# Altium project EMG_MainBoard_Layout.PrjPcb
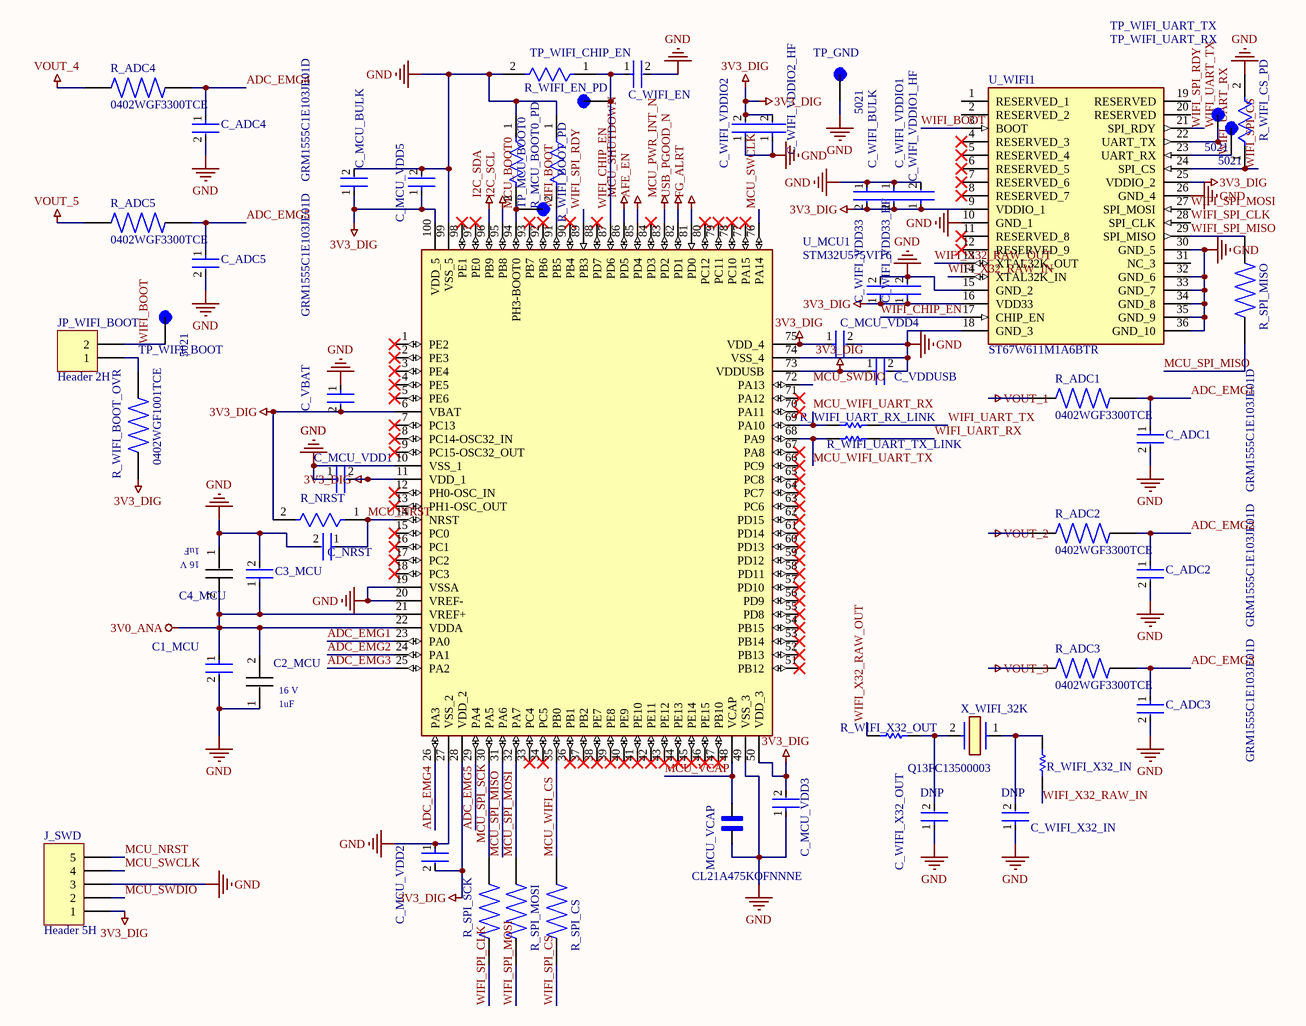
[diagram p0: MCU_sheet.SchDoc]
1 sheet, 59 parts. Net scope: flat (ports and power ports of the same name join across sheets).
Board file: EMG_MainBoard_Layout.PcbDoc

## Sheet MCU_sheet.SchDoc
size 381 x 254 mm; SheetNumber: 8; SheetTotal: 8

### Parts
C1_MCU  GRM155R61C104KA88D  [FP-GRM155-0_05-IPC_C]  (value not drawn)
C2_MCU  MURATA_GRM155C71C105KE11D  [*MURATA_GRM155C71C105KE11D_0]  (value not drawn)
C3_MCU  GRM155R61C104KA88D  [FP-GRM155-0_05-IPC_C]  (value not drawn)
C4_MCU  MURATA_GRM155C71C105KE11D  [*MURATA_GRM155C71C105KE11D_0]  (value not drawn)
C_ADC1  GRM1555C1E103JE01D  [FP-GRM155-0_15-IPC_A]
C_ADC2  GRM1555C1E103JE01D  [FP-GRM155-0_15-IPC_A]
C_ADC3  GRM1555C1E103JE01D  [FP-GRM155-0_15-IPC_A]
C_ADC4  GRM1555C1E103JE01D  [FP-GRM155-0_15-IPC_A]
C_ADC5  GRM1555C1E103JE01D  [FP-GRM155-0_15-IPC_A]
C_MCU_BULK  GCM21BC71E106KE36L  [FP-GCM21B-0_2-e0_2_0_7-MFG]  (value not drawn)
C_MCU_VDD1  GRM155R61C104KA88D  [FP-GRM155-0_05-IPC_C]  (value not drawn)
C_MCU_VDD2  GRM155R61C104KA88D  [FP-GRM155-0_05-IPC_C]  (value not drawn)
C_MCU_VDD3  GRM155R61C104KA88D  [FP-GRM155-0_05-IPC_C]  (value not drawn)
C_MCU_VDD4  GRM155R61C104KA88D  [FP-GRM155-0_05-IPC_C]  (value not drawn)
C_MCU_VDD5  GRM155R61C104KA88D  [FP-GRM155-0_05-IPC_C]  (value not drawn)
C_NRST  GRM155R61C104KA88D  [FP-GRM155-0_05-IPC_C]  (value not drawn)
C_VBAT  GRM155R61C104KA88D  [FP-GRM155-0_05-IPC_C]  (value not drawn)
C_VDDUSB  GRM155R61C104KA88D  [FP-GRM155-0_05-IPC_C]  (value not drawn)
C_WIFI_BULK  GRM219R60J476ME44D  [FP-GRM219-0_2-0_1-IPC_A]  (value not drawn)
C_WIFI_EN  GRM155R61C104KA88D  [FP-GRM155-0_05-IPC_C]  (value not drawn)
C_WIFI_VDD33  GCM21BC71E106KE36L  [FP-GCM21B-0_2-e0_2_0_7-MFG]  (value not drawn)
C_WIFI_VDD33_HF  GRM155R61C104KA88D  [FP-GRM155-0_05-MFG]  (value not drawn)
C_WIFI_VDDIO1  GCM21BC71E106KE36L  [FP-GCM21B-0_2-e0_2_0_7-MFG]  (value not drawn)
C_WIFI_VDDIO1_HF  GRM155R61C104KA88D  [FP-GRM155-0_05-MFG]  (value not drawn)
C_WIFI_VDDIO2  GCM21BC71E106KE36L  [FP-GCM21B-0_2-e0_2_0_7-MFG]  (value not drawn)
C_WIFI_VDDIO2_HF  GRM155R61C104KA88D  [FP-GRM155-0_05-MFG]  (value not drawn)
C_WIFI_X32_IN  DNP  [FP-GRM155-0_05-IPC_C]
C_WIFI_X32_OUT  DNP  [FP-GRM155-0_05-IPC_C]
J_SWD  Header 5H  [HDR1X5H]
JP_WIFI_BOOT  Header 2H  [HDR1X2H]
MCU_VCAP  CL21A475KOFNNNE  [CAPC2012X135N]
R_ADC1  0402WGF3300TCE  [RESC1005X40N]
R_ADC2  0402WGF3300TCE  [RESC1005X40N]
R_ADC3  0402WGF3300TCE  [RESC1005X40N]
R_ADC4  0402WGF3300TCE  [RESC1005X40N]
R_ADC5  0402WGF3300TCE  [RESC1005X40N]
R_MCU_BOOT0_PD  RT0402BRD0710KL  [FP-RT0402-MFG]  (value not drawn)
R_NRST  RT0402BRD0710KL  [FP-RT0402-MFG]  (value not drawn)
R_SPI_CS  ERJ2RKF22R0X  [RES_ERJ2RKF22R0X]  (value not drawn)
R_SPI_MISO  ERJ2RKF22R0X  [RES_ERJ2RKF22R0X]  (value not drawn)
R_SPI_MOSI  ERJ2RKF22R0X  [RES_ERJ2RKF22R0X]  (value not drawn)
R_SPI_SCK  ERJ2RKF22R0X  [RES_ERJ2RKF22R0X]  (value not drawn)
R_WIFI_BOOT_OVR  0402WGF1001TCE  [RESC1005X40N]
R_WIFI_BOOT_PD  RT0402BRD0710KL  [FP-RT0402-MFG]  (value not drawn)
R_WIFI_CS_PD  RT0402BRD0710KL  [FP-RT0402-MFG]  (value not drawn)
R_WIFI_EN_PD  RT0402BRD0710KL  [FP-RT0402-MFG]  (value not drawn)
R_WIFI_UART_RX_LINK  ERJ2GE0R00X  [RESC1005X40X25LL05T05]  (value not drawn)
R_WIFI_UART_TX_LINK  ERJ2GE0R00X  [RESC1005X40X25LL05T05]  (value not drawn)
R_WIFI_X32_IN  ERJ2GE0R00X  [RESC1005X40X25LL05T05]  (value not drawn)
R_WIFI_X32_OUT  ERJ2GE0R00X  [RESC1005X40X25LL05T05]  (value not drawn)
TP_GND  5021  [TP_5021]
TP_MCU_BOOT0  5021  [TP_5021]  (value not drawn)
TP_WIFI_BOOT  5021  [TP_5021]
TP_WIFI_CHIP_EN  5021  [TP_5021]  (value not drawn)
TP_WIFI_UART_RX  5021  [TP_5021]
TP_WIFI_UART_TX  5021  [TP_5021]
U_MCU1  STM32U575VIT6  [QFP50P1600X1600X160-100N]
U_WIFI1  ST67W611M1A6BTR  [ST67W611M1A6BTR]
X_WIFI_32K  Q13FC13500003  [EMG_FC135_3215_2P]

### Nets
3V0_ANA: C1_MCU.1 C2_MCU.2 C3_MCU.1 C4_MCU.2 U_MCU1.21(VREF+) U_MCU1.22(VDDA)
3V3_DIG: C_MCU_BULK.1 C_MCU_VDD1.2 C_MCU_VDD2.2 C_MCU_VDD3.2 C_MCU_VDD4.1 C_MCU_VDD5.1 C_VBAT.2 C_VDDUSB.1 C_WIFI_BULK.2 C_WIFI_VDD33.1 C_WIFI_VDD33_HF.1 C_WIFI_VDDIO1.2 C_WIFI_VDDIO1_HF.1 C_WIFI_VDDIO2.2 C_WIFI_VDDIO2_HF.2 J_SWD.1 R_NRST.2 R_WIFI_BOOT_OVR.1 U_MCU1.6(VBAT) U_MCU1.11(VDD_1) U_MCU1.28(VDD_2) U_MCU1.50(VDD_3) U_MCU1.73(VDDUSB) U_MCU1.75(VDD_4) U_MCU1.100(VDD_5) U_WIFI1.9(VDDIO_1) U_WIFI1.16(VDD33) U_WIFI1.25(VDDIO_2)
AFE_EN: U_MCU1.85(PD4)
FG_ALRT: U_MCU1.81(PD0)
GND: C1_MCU.2 C2_MCU.1 C3_MCU.2 C4_MCU.1 C_ADC1.2 C_ADC2.2 C_ADC3.2 C_ADC4.2 C_ADC5.2 C_MCU_BULK.2 C_MCU_VDD1.1 C_MCU_VDD2.1 C_MCU_VDD3.1 C_MCU_VDD4.2 C_MCU_VDD5.2 C_NRST.2 C_VBAT.1 C_VDDUSB.2 C_WIFI_BULK.1 C_WIFI_EN.2 C_WIFI_VDD33.2 C_WIFI_VDD33_HF.2 C_WIFI_VDDIO1.1 C_WIFI_VDDIO1_HF.2 C_WIFI_VDDIO2.1 C_WIFI_VDDIO2_HF.1 C_WIFI_X32_IN.1 C_WIFI_X32_OUT.1 J_SWD.3 MCU_VCAP.1 R_MCU_BOOT0_PD.1 R_WIFI_BOOT_PD.1 R_WIFI_CS_PD.2 R_WIFI_EN_PD.2 TP_GND.TP U_MCU1.10(VSS_1) U_MCU1.19(VSSA) U_MCU1.20(VREF-) U_MCU1.27(VSS_2) U_MCU1.49(VSS_3) U_MCU1.74(VSS_4) U_MCU1.99(VSS_5) U_WIFI1.10(GND_1) U_WIFI1.15(GND_2) U_WIFI1.18(GND_3) U_WIFI1.26(GND_4) U_WIFI1.30(GND_5) U_WIFI1.32(GND_6) U_WIFI1.33(GND_7) U_WIFI1.34(GND_8) U_WIFI1.35(GND_9) U_WIFI1.36(GND_10)
I2C_SCL: U_MCU1.95(PB8)
I2C_SDA: U_MCU1.96(PB9)
MCU_PWR_INT_N: U_MCU1.83(PD2)
MCU_SHUTDOWN: U_MCU1.86(PD5)
USB_PGOOD_N: U_MCU1.82(PD1)
VOUT_1: R_ADC1.1
VOUT_2: R_ADC2.1
VOUT_3: R_ADC3.1
VOUT_4: R_ADC4.1
VOUT_5: R_ADC5.1
ADC_EMG1: C_ADC1.1 R_ADC1.2 U_MCU1.23(PA0)
ADC_EMG2: C_ADC2.1 R_ADC2.2 U_MCU1.24(PA1)
ADC_EMG3: C_ADC3.1 R_ADC3.2 U_MCU1.25(PA2)
ADC_EMG4: C_ADC4.1 R_ADC4.2 U_MCU1.26(PA3)
ADC_EMG5: C_ADC5.1 R_ADC5.2 U_MCU1.29(PA4)
MCU_BOOT0: R_MCU_BOOT0_PD.2 TP_MCU_BOOT0.TP U_MCU1.94(PH3-BOOT0)
MCU_NRST: C_NRST.1 J_SWD.5 R_NRST.1 U_MCU1.14(NRST)
MCU_SPI_MISO: R_SPI_MISO.2 U_MCU1.31(PA6)
MCU_SPI_MOSI: R_SPI_MOSI.2 U_MCU1.32(PA7)
MCU_SPI_SCK: R_SPI_SCK.2 U_MCU1.30(PA5)
MCU_SWCLK: J_SWD.4 U_MCU1.76(PA14)
MCU_SWDIO: J_SWD.2 U_MCU1.72(PA13)
MCU_VCAP: MCU_VCAP.2 U_MCU1.48(VCAP)
MCU_WIFI_CS: R_SPI_CS.2 U_MCU1.35(PB0)
MCU_WIFI_UART_RX: R_WIFI_UART_RX_LINK.2 U_MCU1.69(PA10)
MCU_WIFI_UART_TX: R_WIFI_UART_TX_LINK.2 U_MCU1.68(PA9)
WIFI_BOOT: JP_WIFI_BOOT.2 R_WIFI_BOOT_PD.2 TP_WIFI_BOOT.TP U_MCU1.91(PB5) U_WIFI1.3(BOOT)
WIFI_CHIP_EN: C_WIFI_EN.1 R_WIFI_EN_PD.1 TP_WIFI_CHIP_EN.TP U_MCU1.87(PD6) U_WIFI1.17(CHIP_EN)
WIFI_SPI_CLK: R_SPI_SCK.1 U_WIFI1.28(SPI_CLK)
WIFI_SPI_CS: R_SPI_CS.1 R_WIFI_CS_PD.1 U_WIFI1.24(SPI_CS)
WIFI_SPI_MISO: R_SPI_MISO.1 U_WIFI1.29(SPI_MISO)
WIFI_SPI_MOSI: R_SPI_MOSI.1 U_WIFI1.27(SPI_MOSI)
WIFI_SPI_RDY: U_MCU1.89(PB3) U_WIFI1.21(SPI_RDY)
WIFI_UART_RX: R_WIFI_UART_TX_LINK.1 TP_WIFI_UART_RX.TP U_WIFI1.23(UART_RX)
WIFI_UART_TX: R_WIFI_UART_RX_LINK.1 TP_WIFI_UART_TX.TP U_WIFI1.22(UART_TX)
WIFI_X32_RAW_IN: R_WIFI_X32_IN.2 U_WIFI1.14(XTAL32K_IN)
WIFI_X32_RAW_OUT: R_WIFI_X32_OUT.2 U_WIFI1.13(XTAL32K_OUT)
NetC_WIFI_X32_IN_2: C_WIFI_X32_IN.2 R_WIFI_X32_IN.1 X_WIFI_32K.1(CRYSTAL_1)
NetC_WIFI_X32_OUT_2: C_WIFI_X32_OUT.2 R_WIFI_X32_OUT.1 X_WIFI_32K.2(CRYSTAL_2)
NetJP_WIFI_BOOT_1: JP_WIFI_BOOT.1 R_WIFI_BOOT_OVR.2

Not connected (* = marked no-connect by the designer): U_MCU1 1(PE2)* 2(PE3)* 3(PE4)* 4(PE5)* 5(PE6)* 7(PC13)* 8(PC14-OSC32_IN)* 9(PC15-OSC32_OUT)* 12(PH0-OSC_IN)* 13(PH1-OSC_OUT)* 15(PC0)* 16(PC1)* 17(PC2)* 18(PC3)* 33(PC4)* 34(PC5)* 36(PB1)* 37(PB2)* 38(PE7)* 39(PE8)* 40(PE9)* 41(PE10)* 42(PE11)* 43(PE12)* 44(PE13)* 45(PE14)* 46(PE15)* 47(PB10)* 51(PB12)* 52(PB13)* 53(PB14)* 54(PB15)* 55(PD8)* 56(PD9)* 57(PD10)* 58(PD11)* 59(PD12)* 60(PD13)* 61(PD14)* 62(PD15)* 63(PC6)* 64(PC7)* 65(PC8)* 66(PC9)* 67(PA8)* 70(PA11)* 71(PA12)* 77(PA15)* 78(PC10)* 79(PC11)* 80(PC12)* 84(PD3)* 88(PD7)* 90(PB4)* 92(PB6)* 93(PB7)* 97(PE0)* 98(PE1)*; U_WIFI1 1(RESERVED_1) 2(RESERVED_2) 4(RESERVED_3)* 5(RESERVED_4)* 6(RESERVED_5)* 7(RESERVED_6)* 8(RESERVED_7)* 11(RESERVED_8)* 12(RESERVED_9)* 19(RESERVED) 20(RESERVED) 31(NC_3)

### Notes on the sheet
- I2C_SDA
- (near R_MCU_BOOT0_PD) I2C_SCL
- MCU_SHUTDOWN
- AFE_EN
- MCU_PWR_INT_N
- USB_PGOOD_N
- FG_ALRT
- (in symbol EMG_R5_C2_MCU) 1uF
- (in symbol EMG_R5_C4_MCU) 1uF

### Library data of the parts
C1_MCU = EMG_R5_C1_MCU: CAP CER 0.1UF 16V X5R 0402; Tolerance: 10%; Capacitance: 100nF; Controlled Revision: R5 2026-09-16; project-local frozen symbol/footprint; Size: 0.5mm; Case Code (Imperial): 0402; Voltage: 16V; REACH SVHC: No SVHC; Packaging: Tape and Reel; Case/Package: 0402; Package Quantity: 1; Max Operating Temperature: 85°C; Voltage Rating (DC): 16V; Min Operating Temperature: -55°C; Construction: Flat; Mount: Surface Mount; Voltage Rating: 16V; Thickness: 0.022inch; Depth: 0.5mm; Termination: SMD/SMT; Length: 1mm; Height: 0.5mm; Series: GRM; Radiation Hardening: No; Width: 0.02inch; RoHS Compliant: Yes; Lead Free: Lead Free; Case Code (Metric): 1005; Dielectric: X5R
C2_MCU = EMG_R5_C2_MCU: Murata GRM155C71C105KE11D: 1 uF 16 V X7S +/-10%, 0402/1005 metric; Value: 1 uF; Controlled Revision: R5 2026-09-16; project-local frozen symbol/footprint; Voltage Rating: 16 V; SnapEDA_Link: https://www.snapeda.com/parts/GRM155C71C105KE11D/Murata/view-part/?ref=snap; Package: 0402 / 1005 metric; MF: Murata; MP: GRM155C71C105KE11D; Check_prices: https://www.snapeda.com/parts/GRM155C71C105KE11D/Murata/view-part/?ref=eda; Manufacturer: Murata; Manufacturer Part Number: GRM155C71C105KE11D; Capacitance: 1 uF; Dielectric: X7S; Tolerance: +/-10%
C3_MCU = EMG_R5_C3_MCU: CAP CER 0.1UF 16V X5R 0402; Tolerance: 10%; Capacitance: 100nF; Controlled Revision: R5 2026-09-16; project-local frozen symbol/footprint; Size: 0.5mm; Case Code (Imperial): 0402; Voltage: 16V; REACH SVHC: No SVHC; Packaging: Tape and Reel; Case/Package: 0402; Package Quantity: 1; Max Operating Temperature: 85°C; Voltage Rating (DC): 16V; Min Operating Temperature: -55°C; Construction: Flat; Mount: Surface Mount; Voltage Rating: 16V; Thickness: 0.022inch; Depth: 0.5mm; Termination: SMD/SMT; Length: 1mm; Height: 0.5mm; Series: GRM; Radiation Hardening: No; Width: 0.02inch; RoHS Compliant: Yes; Lead Free: Lead Free; Case Code (Metric): 1005; Dielectric: X5R
C4_MCU = EMG_R5_C4_MCU: Murata GRM155C71C105KE11D: 1 uF 16 V X7S +/-10%, 0402/1005 metric; Value: 1 uF; Controlled Revision: R5 2026-09-16; project-local frozen symbol/footprint; Voltage Rating: 16 V; SnapEDA_Link: https://www.snapeda.com/parts/GRM155C71C105KE11D/Murata/view-part/?ref=snap; Package: 0402 / 1005 metric; MF: Murata; MP: GRM155C71C105KE11D; Check_prices: https://www.snapeda.com/parts/GRM155C71C105KE11D/Murata/view-part/?ref=eda; Manufacturer: Murata; Manufacturer Part Number: GRM155C71C105KE11D; Capacitance: 1 uF; Dielectric: X7S; Tolerance: +/-10%
C_ADC1 = EMG_R5_C_ADC1: Chip Multilayer Ceramic Capacitors for General Purpose, 0402, 10000pF, C0G, 30ppm/°C, 5%, 25V; Controlled Revision: R5 2026-09-16; project-local frozen symbol/footprint
C_ADC2 = EMG_R5_C_ADC2: Chip Multilayer Ceramic Capacitors for General Purpose, 0402, 10000pF, C0G, 30ppm/°C, 5%, 25V; Controlled Revision: R5 2026-09-16; project-local frozen symbol/footprint
C_ADC3 = EMG_R5_C_ADC3: Chip Multilayer Ceramic Capacitors for General Purpose, 0402, 10000pF, C0G, 30ppm/°C, 5%, 25V; Controlled Revision: R5 2026-09-16; project-local frozen symbol/footprint
C_ADC4 = EMG_R5_C_ADC4: Chip Multilayer Ceramic Capacitors for General Purpose, 0402, 10000pF, C0G, 30ppm/°C, 5%, 25V; Controlled Revision: R5 2026-09-16; project-local frozen symbol/footprint
C_ADC5 = EMG_R5_C_ADC5: Chip Multilayer Ceramic Capacitors for General Purpose, 0402, 10000pF, C0G, 30ppm/°C, 5%, 25V; Controlled Revision: R5 2026-09-16; project-local frozen symbol/footprint
C_MCU_BULK = EMG_R5_C_MCU_BULK: 10 µF ±10% 25V Ceramic Capacitor X7S 0805 (2012 Metric); Controlled Revision: R5 2026-09-16; project-local frozen symbol/footprint
C_MCU_VDD1 = EMG_R5_C_MCU_VDD1: CAP CER 0.1UF 16V X5R 0402; Tolerance: 10%; Capacitance: 100nF; Controlled Revision: R5 2026-09-16; project-local frozen symbol/footprint; Size: 0.5mm; Case Code (Imperial): 0402; Voltage: 16V; REACH SVHC: No SVHC; Packaging: Tape and Reel; Case/Package: 0402; Package Quantity: 1; Max Operating Temperature: 85°C; Voltage Rating (DC): 16V; Min Operating Temperature: -55°C; Construction: Flat; Mount: Surface Mount; Voltage Rating: 16V; Thickness: 0.022inch; Depth: 0.5mm; Termination: SMD/SMT; Length: 1mm; Height: 0.5mm; Series: GRM; Radiation Hardening: No; Width: 0.02inch; RoHS Compliant: Yes; Lead Free: Lead Free; Case Code (Metric): 1005; Dielectric: X5R
C_MCU_VDD2 = EMG_R5_C_MCU_VDD2: CAP CER 0.1UF 16V X5R 0402; Tolerance: 10%; Capacitance: 100nF; Controlled Revision: R5 2026-09-16; project-local frozen symbol/footprint; Size: 0.5mm; Case Code (Imperial): 0402; Voltage: 16V; REACH SVHC: No SVHC; Packaging: Tape and Reel; Case/Package: 0402; Package Quantity: 1; Max Operating Temperature: 85°C; Voltage Rating (DC): 16V; Min Operating Temperature: -55°C; Construction: Flat; Mount: Surface Mount; Voltage Rating: 16V; Thickness: 0.022inch; Depth: 0.5mm; Termination: SMD/SMT; Length: 1mm; Height: 0.5mm; Series: GRM; Radiation Hardening: No; Width: 0.02inch; RoHS Compliant: Yes; Lead Free: Lead Free; Case Code (Metric): 1005; Dielectric: X5R
C_MCU_VDD3 = EMG_R5_C_MCU_VDD3: CAP CER 0.1UF 16V X5R 0402; Tolerance: 10%; Capacitance: 100nF; Controlled Revision: R5 2026-09-16; project-local frozen symbol/footprint; Size: 0.5mm; Case Code (Imperial): 0402; Voltage: 16V; REACH SVHC: No SVHC; Packaging: Tape and Reel; Case/Package: 0402; Package Quantity: 1; Max Operating Temperature: 85°C; Voltage Rating (DC): 16V; Min Operating Temperature: -55°C; Construction: Flat; Mount: Surface Mount; Voltage Rating: 16V; Thickness: 0.022inch; Depth: 0.5mm; Termination: SMD/SMT; Length: 1mm; Height: 0.5mm; Series: GRM; Radiation Hardening: No; Width: 0.02inch; RoHS Compliant: Yes; Lead Free: Lead Free; Case Code (Metric): 1005; Dielectric: X5R
C_MCU_VDD4 = EMG_R5_C_MCU_VDD4: CAP CER 0.1UF 16V X5R 0402; Tolerance: 10%; Capacitance: 100nF; Controlled Revision: R5 2026-09-16; project-local frozen symbol/footprint; Size: 0.5mm; Case Code (Imperial): 0402; Voltage: 16V; REACH SVHC: No SVHC; Packaging: Tape and Reel; Case/Package: 0402; Package Quantity: 1; Max Operating Temperature: 85°C; Voltage Rating (DC): 16V; Min Operating Temperature: -55°C; Construction: Flat; Mount: Surface Mount; Voltage Rating: 16V; Thickness: 0.022inch; Depth: 0.5mm; Termination: SMD/SMT; Length: 1mm; Height: 0.5mm; Series: GRM; Radiation Hardening: No; Width: 0.02inch; RoHS Compliant: Yes; Lead Free: Lead Free; Case Code (Metric): 1005; Dielectric: X5R
C_MCU_VDD5 = EMG_R5_C_MCU_VDD5: CAP CER 0.1UF 16V X5R 0402; Tolerance: 10%; Capacitance: 100nF; Controlled Revision: R5 2026-09-16; project-local frozen symbol/footprint; Size: 0.5mm; Case Code (Imperial): 0402; Voltage: 16V; REACH SVHC: No SVHC; Packaging: Tape and Reel; Case/Package: 0402; Package Quantity: 1; Max Operating Temperature: 85°C; Voltage Rating (DC): 16V; Min Operating Temperature: -55°C; Construction: Flat; Mount: Surface Mount; Voltage Rating: 16V; Thickness: 0.022inch; Depth: 0.5mm; Termination: SMD/SMT; Length: 1mm; Height: 0.5mm; Series: GRM; Radiation Hardening: No; Width: 0.02inch; RoHS Compliant: Yes; Lead Free: Lead Free; Case Code (Metric): 1005; Dielectric: X5R
C_NRST = EMG_R5_C_NRST: CAP CER 0.1UF 16V X5R 0402; Tolerance: 10%; Capacitance: 100nF; Controlled Revision: R5 2026-09-16; project-local frozen symbol/footprint; Size: 0.5mm; Case Code (Imperial): 0402; Voltage: 16V; REACH SVHC: No SVHC; Packaging: Tape and Reel; Case/Package: 0402; Package Quantity: 1; Max Operating Temperature: 85°C; Voltage Rating (DC): 16V; Min Operating Temperature: -55°C; Construction: Flat; Mount: Surface Mount; Voltage Rating: 16V; Thickness: 0.022inch; Depth: 0.5mm; Termination: SMD/SMT; Length: 1mm; Height: 0.5mm; Series: GRM; Radiation Hardening: No; Width: 0.02inch; RoHS Compliant: Yes; Lead Free: Lead Free; Case Code (Metric): 1005; Dielectric: X5R
C_VBAT = EMG_R5_C_VBAT: CAP CER 0.1UF 16V X5R 0402; Tolerance: 10%; Capacitance: 100nF; Controlled Revision: R5 2026-09-16; project-local frozen symbol/footprint; Size: 0.5mm; Case Code (Imperial): 0402; Voltage: 16V; REACH SVHC: No SVHC; Packaging: Tape and Reel; Case/Package: 0402; Package Quantity: 1; Max Operating Temperature: 85°C; Voltage Rating (DC): 16V; Min Operating Temperature: -55°C; Construction: Flat; Mount: Surface Mount; Voltage Rating: 16V; Thickness: 0.022inch; Depth: 0.5mm; Termination: SMD/SMT; Length: 1mm; Height: 0.5mm; Series: GRM; Radiation Hardening: No; Width: 0.02inch; RoHS Compliant: Yes; Lead Free: Lead Free; Case Code (Metric): 1005; Dielectric: X5R
C_VDDUSB = EMG_R5_C_VDDUSB: CAP CER 0.1UF 16V X5R 0402; Tolerance: 10%; Capacitance: 100nF; Controlled Revision: R5 2026-09-16; project-local frozen symbol/footprint; Size: 0.5mm; Case Code (Imperial): 0402; Voltage: 16V; REACH SVHC: No SVHC; Packaging: Tape and Reel; Case/Package: 0402; Package Quantity: 1; Max Operating Temperature: 85°C; Voltage Rating (DC): 16V; Min Operating Temperature: -55°C; Construction: Flat; Mount: Surface Mount; Voltage Rating: 16V; Thickness: 0.022inch; Depth: 0.5mm; Termination: SMD/SMT; Length: 1mm; Height: 0.5mm; Series: GRM; Radiation Hardening: No; Width: 0.02inch; RoHS Compliant: Yes; Lead Free: Lead Free; Case Code (Metric): 1005; Dielectric: X5R
C_WIFI_BULK = EMG_R5_C_WIFI_BULK: Chip Multilayer Ceramic Capacitors for General Purpose, 0805, 47uF, X5R, 15%, 20%, 6.3V; Assembly PROTO_1: Not Fitted; Release Note: Optional 47 uF radio bulk; retained footprint, initial prototype DNP; Controlled Revision: R5 2026-09-16; project-local frozen symbol/footprint; Assembly PROTO_1_REMOTE_NTC: Not Fitted; Case Code (Metric): 2012; Voltage Rating: 6.3V; Case Code (Imperial): 0805; Max Operating Temperature: 85°C; Width: 0.049inch; Length: 0.079inch; Min Operating Temperature: -55°C; Mount: Surface Mount; Packaging: Tape and Reel; Case/Package: 0805; Thickness: 0.037inch; Capacitance: 47uF; Tolerance: 20%
C_WIFI_EN = EMG_R5_C_WIFI_EN: CAP CER 0.1UF 16V X5R 0402; Tolerance: 10%; Capacitance: 100nF; Controlled Revision: R5 2026-09-16; project-local frozen symbol/footprint; Size: 0.5mm; Case Code (Imperial): 0402; Voltage: 16V; REACH SVHC: No SVHC; Packaging: Tape and Reel; Case/Package: 0402; Package Quantity: 1; Max Operating Temperature: 85°C; Voltage Rating (DC): 16V; Min Operating Temperature: -55°C; Construction: Flat; Mount: Surface Mount; Voltage Rating: 16V; Thickness: 0.022inch; Depth: 0.5mm; Termination: SMD/SMT; Length: 1mm; Height: 0.5mm; Series: GRM; Radiation Hardening: No; Width: 0.02inch; RoHS Compliant: Yes; Lead Free: Lead Free; Case Code (Metric): 1005; Dielectric: X5R
C_WIFI_VDD33 = EMG_R5_C_WIFI_VDD33: 10 µF ±10% 25V Ceramic Capacitor X7S 0805 (2012 Metric); Controlled Revision: R5 2026-09-16; project-local frozen symbol/footprint
C_WIFI_VDD33_HF = EMG_R5_C_WIFI_VDD33_HF: CAP CER 0.1UF 16V X5R 0402; Tolerance: 10%; Capacitance: 100nF; Controlled Revision: R5 2026-09-16; project-local frozen symbol/footprint; Size: 0.5mm; Case Code (Imperial): 0402; Voltage: 16V; REACH SVHC: No SVHC; Packaging: Tape and Reel; Case/Package: 0402; Package Quantity: 1; Max Operating Temperature: 85°C; Voltage Rating (DC): 16V; Min Operating Temperature: -55°C; Construction: Flat; Mount: Surface Mount; Voltage Rating: 16V; Thickness: 0.022inch; Depth: 0.5mm; Termination: SMD/SMT; Length: 1mm; Height: 0.5mm; Series: GRM; Radiation Hardening: No; Width: 0.02inch; RoHS Compliant: Yes; Lead Free: Lead Free; Case Code (Metric): 1005; Dielectric: X5R
C_WIFI_VDDIO1 = EMG_R5_C_WIFI_VDDIO1: 10 µF ±10% 25V Ceramic Capacitor X7S 0805 (2012 Metric); Controlled Revision: R5 2026-09-16; project-local frozen symbol/footprint
C_WIFI_VDDIO1_HF = EMG_R5_C_WIFI_VDDIO1_HF: CAP CER 0.1UF 16V X5R 0402; Tolerance: 10%; Capacitance: 100nF; Controlled Revision: R5 2026-09-16; project-local frozen symbol/footprint; Size: 0.5mm; Case Code (Imperial): 0402; Voltage: 16V; REACH SVHC: No SVHC; Packaging: Tape and Reel; Case/Package: 0402; Package Quantity: 1; Max Operating Temperature: 85°C; Voltage Rating (DC): 16V; Min Operating Temperature: -55°C; Construction: Flat; Mount: Surface Mount; Voltage Rating: 16V; Thickness: 0.022inch; Depth: 0.5mm; Termination: SMD/SMT; Length: 1mm; Height: 0.5mm; Series: GRM; Radiation Hardening: No; Width: 0.02inch; RoHS Compliant: Yes; Lead Free: Lead Free; Case Code (Metric): 1005; Dielectric: X5R
C_WIFI_VDDIO2 = EMG_R5_C_WIFI_VDDIO2: 10 µF ±10% 25V Ceramic Capacitor X7S 0805 (2012 Metric); Controlled Revision: R5 2026-09-16; project-local frozen symbol/footprint
C_WIFI_VDDIO2_HF = EMG_R5_C_WIFI_VDDIO2_HF: CAP CER 0.1UF 16V X5R 0402; Tolerance: 10%; Capacitance: 100nF; Controlled Revision: R5 2026-09-16; project-local frozen symbol/footprint; Size: 0.5mm; Case Code (Imperial): 0402; Voltage: 16V; REACH SVHC: No SVHC; Packaging: Tape and Reel; Case/Package: 0402; Package Quantity: 1; Max Operating Temperature: 85°C; Voltage Rating (DC): 16V; Min Operating Temperature: -55°C; Construction: Flat; Mount: Surface Mount; Voltage Rating: 16V; Thickness: 0.022inch; Depth: 0.5mm; Termination: SMD/SMT; Length: 1mm; Height: 0.5mm; Series: GRM; Radiation Hardening: No; Width: 0.02inch; RoHS Compliant: Yes; Lead Free: Lead Free; Case Code (Metric): 1005; Dielectric: X5R
C_WIFI_X32_IN = EMG_R5_C_WIFI_X32_IN: DNP - 32 kHz crystal tuning capacitor; no fitted value or MPN; retain 0402 footprint; Value: DNP - tuning; Assembly PROTO_1: Not Fitted; Release Note: No fitted capacitance or MPN. Qualify pF tuning if required; never fit copied 100 nF.; Controlled Revision: R5 2026-09-16; project-local frozen symbol/footprint; Assembly PROTO_1_REMOTE_NTC: Not Fitted; Package: 0402 / 1005 metric
C_WIFI_X32_OUT = EMG_R5_C_WIFI_X32_OUT: DNP - 32 kHz crystal tuning capacitor; no fitted value or MPN; retain 0402 footprint; Value: DNP - tuning; Assembly PROTO_1: Not Fitted; Release Note: No fitted capacitance or MPN. Qualify pF tuning if required; never fit copied 100 nF.; Controlled Revision: R5 2026-09-16; project-local frozen symbol/footprint; Assembly PROTO_1_REMOTE_NTC: Not Fitted; Package: 0402 / 1005 metric
J_SWD = EMG_R5_J_SWD: Header, 5-Pin, Right Angle; Controlled Revision: R5 2026-09-16; project-local frozen symbol/footprint; Production Release Blocker: Freeze exact orderable manufacturer/MPN, package/mating/contact definition before production; do not infer from generic symbol.; LatestRevisionDate: 17-Jul-2002; LatestRevisionNote: Re-released for DXP Platform.; Publisher: Altium Limited
JP_WIFI_BOOT = EMG_R5_JP_WIFI_BOOT: Header, 2-Pin, Right Angle; Controlled Revision: R5 2026-09-16; project-local frozen symbol/footprint; Production Release Blocker: Freeze exact orderable manufacturer/MPN, package/mating/contact definition before production; do not infer from generic symbol.; LatestRevisionDate: 17-Jul-2002; LatestRevisionNote: Re-released for DXP Platform.; Publisher: Altium Limited
MCU_VCAP = EMG_R5_MCU_VCAP: 4.7 ÂµF Â±10% 16V Ceramic Capacitor X5R 0805 (2012 Metric); MF: Samsung; Controlled Revision: R5 2026-09-16; project-local frozen symbol/footprint; SnapEDA_Link: https://www.snapeda.com/parts/CL21A475KOFNNNE/Samsung/view-part/?ref=snap; Package: SMD-2 Samsung; Value: *; MP: CL21A475KOFNNNE; Check_prices: https://www.snapeda.com/parts/CL21A475KOFNNNE/Samsung/view-part/?ref=eda
R_ADC1 = EMG_R5_R_ADC1: 330 Ohm 1/16W Thick Film Resistor 0402 Chip - Surface Mount; MF: Uni-Royal; Controlled Revision: R5 2026-09-16; project-local frozen symbol/footprint; SnapEDA_Link: https://www.snapeda.com/parts/0402WGF3300TCE/Uni-Royal/view-part/?ref=snap; Package: 0402-2 ROYAL; Value: *; MP: 0402WGF3300TCE; Check_prices: https://www.snapeda.com/parts/0402WGF3300TCE/Uni-Royal/view-part/?ref=eda
R_ADC2 = EMG_R5_R_ADC2: 330 Ohm 1/16W Thick Film Resistor 0402 Chip - Surface Mount; MF: Uni-Royal; Controlled Revision: R5 2026-09-16; project-local frozen symbol/footprint; SnapEDA_Link: https://www.snapeda.com/parts/0402WGF3300TCE/Uni-Royal/view-part/?ref=snap; Package: 0402-2 ROYAL; Value: *; MP: 0402WGF3300TCE; Check_prices: https://www.snapeda.com/parts/0402WGF3300TCE/Uni-Royal/view-part/?ref=eda
R_ADC3 = EMG_R5_R_ADC3: 330 Ohm 1/16W Thick Film Resistor 0402 Chip - Surface Mount; MF: Uni-Royal; Controlled Revision: R5 2026-09-16; project-local frozen symbol/footprint; SnapEDA_Link: https://www.snapeda.com/parts/0402WGF3300TCE/Uni-Royal/view-part/?ref=snap; Package: 0402-2 ROYAL; Value: *; MP: 0402WGF3300TCE; Check_prices: https://www.snapeda.com/parts/0402WGF3300TCE/Uni-Royal/view-part/?ref=eda
R_ADC4 = EMG_R5_R_ADC4: 330 Ohm 1/16W Thick Film Resistor 0402 Chip - Surface Mount; MF: Uni-Royal; Controlled Revision: R5 2026-09-16; project-local frozen symbol/footprint; SnapEDA_Link: https://www.snapeda.com/parts/0402WGF3300TCE/Uni-Royal/view-part/?ref=snap; Package: 0402-2 ROYAL; Value: *; MP: 0402WGF3300TCE; Check_prices: https://www.snapeda.com/parts/0402WGF3300TCE/Uni-Royal/view-part/?ref=eda
R_ADC5 = EMG_R5_R_ADC5: 330 Ohm 1/16W Thick Film Resistor 0402 Chip - Surface Mount; MF: Uni-Royal; Controlled Revision: R5 2026-09-16; project-local frozen symbol/footprint; SnapEDA_Link: https://www.snapeda.com/parts/0402WGF3300TCE/Uni-Royal/view-part/?ref=snap; Package: 0402-2 ROYAL; Value: *; MP: 0402WGF3300TCE; Check_prices: https://www.snapeda.com/parts/0402WGF3300TCE/Uni-Royal/view-part/?ref=eda
R_MCU_BOOT0_PD = EMG_R5_R_MCU_BOOT0_PD: RES 10.0K OHM 1/16W .1% SMD 0402; Manufacturer: Yageo; Value: 10KΩ; Voltage Rating: 50V; Power Rating: 0.063W; Temperature Coefficient: 25 ppm/°C; Tolerance: 0.001; Controlled Revision: R5 2026-09-16; project-local frozen symbol/footprint; Height: 0.35mm; Ipc Land Pattern Name: RESC10050X30; Device Class L1: Passive Components; Mouser Description: Thin Film Resistors - SMD 10K ohm 0.1% 1/16W; ComponentLink2URL: http://www.yageo.com/documents/recent/PYu-RT_1-to-0.01_RoHS_L_9.pdf; Automotive: No; Series: RT; Package: RT0402; ComponentLink2Description: Datasheet; Footprint Url: http://www.yageo.com/exep/pages/download/literatures/PYu-R_Mount_10.pdf; Digikey Description: RES 10.0K OHM 1/16W .1% SMD 0402; Resistance: 10KΩ; Temperature Range High: +155°C; Device Class L3: Chip SMD Resistors; Manufacturer Part Number: RT0402BRD0710KL; Lead Free: Yes; Category: Res; Device Class L2: Resistors; RoHS: TRUE; Temperature Range Low: -55°C; Composition: Thin Film; Temperature: -55°C to +155°C; Octopart: https://octopart.com/rt0402brd0710kl-yageo-1181432
R_NRST = EMG_R5_R_NRST: RES 10.0K OHM 1/16W .1% SMD 0402; Manufacturer: Yageo; Value: 10KΩ; Voltage Rating: 50V; Power Rating: 0.063W; Temperature Coefficient: 25 ppm/°C; Tolerance: 0.001; Controlled Revision: R5 2026-09-16; project-local frozen symbol/footprint; Height: 0.35mm; Ipc Land Pattern Name: RESC10050X30; Device Class L1: Passive Components; Mouser Description: Thin Film Resistors - SMD 10K ohm 0.1% 1/16W; ComponentLink2URL: http://www.yageo.com/documents/recent/PYu-RT_1-to-0.01_RoHS_L_9.pdf; Automotive: No; Series: RT; Package: RT0402; ComponentLink2Description: Datasheet; Footprint Url: http://www.yageo.com/exep/pages/download/literatures/PYu-R_Mount_10.pdf; Digikey Description: RES 10.0K OHM 1/16W .1% SMD 0402; Resistance: 10KΩ; Temperature Range High: +155°C; Device Class L3: Chip SMD Resistors; Manufacturer Part Number: RT0402BRD0710KL; Lead Free: Yes; Category: Res; Device Class L2: Resistors; RoHS: TRUE; Temperature Range Low: -55°C; Composition: Thin Film; Temperature: -55°C to +155°C; Octopart: https://octopart.com/rt0402brd0710kl-yageo-1181432
R_SPI_CS = EMG_R5_R_SPI_CS: 22 Ohms Â±1% 0.1W, 1/10W Chip Resistor 0402 (1005 Metric) Automotive AEC-Q200 Thick Film; MF: Panasonic; Controlled Revision: R5 2026-09-16; project-local frozen symbol/footprint; MP: ERJ2RKF22R0X; Package: 1005-2 Panasonic; Value: *; Digi-Key_Part_Number: P22.0LTR-ND; Check_prices: https://www.snapeda.com/parts/ERJ2RKF22R0X/Panasonic/view-part/?ref=eda; SnapEDA_Link: https://www.snapeda.com/parts/ERJ2RKF22R0X/Panasonic/view-part/?ref=snap
R_SPI_MISO = EMG_R5_R_SPI_MISO: 22 Ohms Â±1% 0.1W, 1/10W Chip Resistor 0402 (1005 Metric) Automotive AEC-Q200 Thick Film; MF: Panasonic; Controlled Revision: R5 2026-09-16; project-local frozen symbol/footprint; MP: ERJ2RKF22R0X; Package: 1005-2 Panasonic; Value: *; Digi-Key_Part_Number: P22.0LTR-ND; Check_prices: https://www.snapeda.com/parts/ERJ2RKF22R0X/Panasonic/view-part/?ref=eda; SnapEDA_Link: https://www.snapeda.com/parts/ERJ2RKF22R0X/Panasonic/view-part/?ref=snap
R_SPI_MOSI = EMG_R5_R_SPI_MOSI: 22 Ohms Â±1% 0.1W, 1/10W Chip Resistor 0402 (1005 Metric) Automotive AEC-Q200 Thick Film; MF: Panasonic; Controlled Revision: R5 2026-09-16; project-local frozen symbol/footprint; MP: ERJ2RKF22R0X; Package: 1005-2 Panasonic; Value: *; Digi-Key_Part_Number: P22.0LTR-ND; Check_prices: https://www.snapeda.com/parts/ERJ2RKF22R0X/Panasonic/view-part/?ref=eda; SnapEDA_Link: https://www.snapeda.com/parts/ERJ2RKF22R0X/Panasonic/view-part/?ref=snap
R_SPI_SCK = EMG_R5_R_SPI_SCK: 22 Ohms Â±1% 0.1W, 1/10W Chip Resistor 0402 (1005 Metric) Automotive AEC-Q200 Thick Film; MF: Panasonic; Controlled Revision: R5 2026-09-16; project-local frozen symbol/footprint; MP: ERJ2RKF22R0X; Package: 1005-2 Panasonic; Value: *; Digi-Key_Part_Number: P22.0LTR-ND; Check_prices: https://www.snapeda.com/parts/ERJ2RKF22R0X/Panasonic/view-part/?ref=eda; SnapEDA_Link: https://www.snapeda.com/parts/ERJ2RKF22R0X/Panasonic/view-part/?ref=snap
R_WIFI_BOOT_OVR = EMG_R5_R_WIFI_BOOT_OVR: 1K Ohm 1/16W Thick Film Resistor 0402 Chip - Surface Mount; MF: Uni-Royal; Controlled Revision: R5 2026-09-16; project-local frozen symbol/footprint; SnapEDA_Link: https://www.snapeda.com/parts/0402WGF1001TCE/Uni-Royal/view-part/?ref=snap; Package: 0402-2 ROYAL; Value: *; MP: 0402WGF1001TCE; Check_prices: https://www.snapeda.com/parts/0402WGF1001TCE/Uni-Royal/view-part/?ref=eda
R_WIFI_BOOT_PD = EMG_R5_R_WIFI_BOOT_PD: RES 10.0K OHM 1/16W .1% SMD 0402; Manufacturer: Yageo; Value: 10KΩ; Voltage Rating: 50V; Power Rating: 0.063W; Temperature Coefficient: 25 ppm/°C; Tolerance: 0.001; Controlled Revision: R5 2026-09-16; project-local frozen symbol/footprint; Height: 0.35mm; Ipc Land Pattern Name: RESC10050X30; Device Class L1: Passive Components; Mouser Description: Thin Film Resistors - SMD 10K ohm 0.1% 1/16W; ComponentLink2URL: http://www.yageo.com/documents/recent/PYu-RT_1-to-0.01_RoHS_L_9.pdf; Automotive: No; Series: RT; Package: RT0402; ComponentLink2Description: Datasheet; Footprint Url: http://www.yageo.com/exep/pages/download/literatures/PYu-R_Mount_10.pdf; Digikey Description: RES 10.0K OHM 1/16W .1% SMD 0402; Resistance: 10KΩ; Temperature Range High: +155°C; Device Class L3: Chip SMD Resistors; Manufacturer Part Number: RT0402BRD0710KL; Lead Free: Yes; Category: Res; Device Class L2: Resistors; RoHS: TRUE; Temperature Range Low: -55°C; Composition: Thin Film; Temperature: -55°C to +155°C; Octopart: https://octopart.com/rt0402brd0710kl-yageo-1181432
R_WIFI_CS_PD = EMG_R5_R_WIFI_CS_PD: RES 10.0K OHM 1/16W .1% SMD 0402; Manufacturer: Yageo; Value: 10KΩ; Voltage Rating: 50V; Power Rating: 0.063W; Temperature Coefficient: 25 ppm/°C; Tolerance: 0.001; Controlled Revision: R5 2026-09-16; project-local frozen symbol/footprint; Height: 0.35mm; Ipc Land Pattern Name: RESC10050X30; Device Class L1: Passive Components; Mouser Description: Thin Film Resistors - SMD 10K ohm 0.1% 1/16W; ComponentLink2URL: http://www.yageo.com/documents/recent/PYu-RT_1-to-0.01_RoHS_L_9.pdf; Automotive: No; Series: RT; Package: RT0402; ComponentLink2Description: Datasheet; Footprint Url: http://www.yageo.com/exep/pages/download/literatures/PYu-R_Mount_10.pdf; Digikey Description: RES 10.0K OHM 1/16W .1% SMD 0402; Resistance: 10KΩ; Temperature Range High: +155°C; Device Class L3: Chip SMD Resistors; Manufacturer Part Number: RT0402BRD0710KL; Lead Free: Yes; Category: Res; Device Class L2: Resistors; RoHS: TRUE; Temperature Range Low: -55°C; Composition: Thin Film; Temperature: -55°C to +155°C; Octopart: https://octopart.com/rt0402brd0710kl-yageo-1181432
R_WIFI_EN_PD = EMG_R5_R_WIFI_EN_PD: RES 10.0K OHM 1/16W .1% SMD 0402; Manufacturer: Yageo; Value: 10KΩ; Voltage Rating: 50V; Power Rating: 0.063W; Temperature Coefficient: 25 ppm/°C; Tolerance: 0.001; Controlled Revision: R5 2026-09-16; project-local frozen symbol/footprint; Height: 0.35mm; Ipc Land Pattern Name: RESC10050X30; Device Class L1: Passive Components; Mouser Description: Thin Film Resistors - SMD 10K ohm 0.1% 1/16W; ComponentLink2URL: http://www.yageo.com/documents/recent/PYu-RT_1-to-0.01_RoHS_L_9.pdf; Automotive: No; Series: RT; Package: RT0402; ComponentLink2Description: Datasheet; Footprint Url: http://www.yageo.com/exep/pages/download/literatures/PYu-R_Mount_10.pdf; Digikey Description: RES 10.0K OHM 1/16W .1% SMD 0402; Resistance: 10KΩ; Temperature Range High: +155°C; Device Class L3: Chip SMD Resistors; Manufacturer Part Number: RT0402BRD0710KL; Lead Free: Yes; Category: Res; Device Class L2: Resistors; RoHS: TRUE; Temperature Range Low: -55°C; Composition: Thin Film; Temperature: -55°C to +155°C; Octopart: https://octopart.com/rt0402brd0710kl-yageo-1181432
R_WIFI_UART_RX_LINK = EMG_R5_R_WIFI_UART_RX_LINK: Chip Resistor, 0 Ohm, 0.1 W, -55 to 155 degC, 0402 (1005 Metric), RoHS, Tape and Reel; Manufacturer: Panasonic; Voltage Rating (DC): 50V; Temperature Coefficient: 600ppm/��C; Max Power Dissipation: 100mW; Resistance: 0mOhm; Tolerance: 5%; Controlled Revision: R5 2026-09-16; project-local frozen symbol/footprint; Number of Terminations: 2; Mount: SurfaceMount; Height: 0.35mm; Packaging: TapeandReel; Contact Plating: Tin; Manufacturer URL: http://www.panasonic.com/; Composition: ThickFilm; Max Operating Temperature: 155degC; REACH SVHC: NoSVHC; Case/Package: 0402; Package Reference: 402; Depth: 0.5mm; Package Description: 2-Pin Surface Mount Device, Body 1 x 0.5 mm; Datasheet URL: https://industrial.panasonic.com/cdbs/www-data/pdf/RDA0000/AOA0000C301.pdf; RoHSCompliant: True; Case Code (Imperial): 0402; Military Standard: Not; Min Operating Temperature: -55degC; Power Rating: 100mW; Datasheet Version: 03/2015; Length: 1mm; Case Code (Metric): 1005; Termination: SMD/SMT; Mounting Technology: SurfaceMount; Voltage Rating: 50V; Width: 0.02inch; Package Quantity: 1; Lead Free: LeadFree; Radiation Hardening: No
R_WIFI_UART_TX_LINK = EMG_R5_R_WIFI_UART_TX_LINK: Chip Resistor, 0 Ohm, 0.1 W, -55 to 155 degC, 0402 (1005 Metric), RoHS, Tape and Reel; Manufacturer: Panasonic; Voltage Rating (DC): 50V; Temperature Coefficient: 600ppm/��C; Max Power Dissipation: 100mW; Resistance: 0mOhm; Tolerance: 5%; Controlled Revision: R5 2026-09-16; project-local frozen symbol/footprint; Number of Terminations: 2; Mount: SurfaceMount; Height: 0.35mm; Packaging: TapeandReel; Contact Plating: Tin; Manufacturer URL: http://www.panasonic.com/; Composition: ThickFilm; Max Operating Temperature: 155degC; REACH SVHC: NoSVHC; Case/Package: 0402; Package Reference: 402; Depth: 0.5mm; Package Description: 2-Pin Surface Mount Device, Body 1 x 0.5 mm; Datasheet URL: https://industrial.panasonic.com/cdbs/www-data/pdf/RDA0000/AOA0000C301.pdf; RoHSCompliant: True; Case Code (Imperial): 0402; Military Standard: Not; Min Operating Temperature: -55degC; Power Rating: 100mW; Datasheet Version: 03/2015; Length: 1mm; Case Code (Metric): 1005; Termination: SMD/SMT; Mounting Technology: SurfaceMount; Voltage Rating: 50V; Width: 0.02inch; Package Quantity: 1; Lead Free: LeadFree; Radiation Hardening: No
R_WIFI_X32_IN = EMG_R5_R_WIFI_X32_IN: Chip Resistor, 0 Ohm, 0.1 W, -55 to 155 degC, 0402 (1005 Metric), RoHS, Tape and Reel; Manufacturer: Panasonic; Voltage Rating (DC): 50V; Temperature Coefficient: 600ppm/��C; Max Power Dissipation: 100mW; Resistance: 0mOhm; Tolerance: 5%; Controlled Revision: R5 2026-09-16; project-local frozen symbol/footprint; Number of Terminations: 2; Mount: SurfaceMount; Height: 0.35mm; Packaging: TapeandReel; Contact Plating: Tin; Manufacturer URL: http://www.panasonic.com/; Composition: ThickFilm; Max Operating Temperature: 155degC; REACH SVHC: NoSVHC; Case/Package: 0402; Package Reference: 402; Depth: 0.5mm; Package Description: 2-Pin Surface Mount Device, Body 1 x 0.5 mm; Datasheet URL: https://industrial.panasonic.com/cdbs/www-data/pdf/RDA0000/AOA0000C301.pdf; RoHSCompliant: True; Case Code (Imperial): 0402; Military Standard: Not; Min Operating Temperature: -55degC; Power Rating: 100mW; Datasheet Version: 03/2015; Length: 1mm; Case Code (Metric): 1005; Termination: SMD/SMT; Mounting Technology: SurfaceMount; Voltage Rating: 50V; Width: 0.02inch; Package Quantity: 1; Lead Free: LeadFree; Radiation Hardening: No
R_WIFI_X32_OUT = EMG_R5_R_WIFI_X32_OUT: Chip Resistor, 0 Ohm, 0.1 W, -55 to 155 degC, 0402 (1005 Metric), RoHS, Tape and Reel; Manufacturer: Panasonic; Voltage Rating (DC): 50V; Temperature Coefficient: 600ppm/��C; Max Power Dissipation: 100mW; Resistance: 0mOhm; Tolerance: 5%; Controlled Revision: R5 2026-09-16; project-local frozen symbol/footprint; Number of Terminations: 2; Mount: SurfaceMount; Height: 0.35mm; Packaging: TapeandReel; Contact Plating: Tin; Manufacturer URL: http://www.panasonic.com/; Composition: ThickFilm; Max Operating Temperature: 155degC; REACH SVHC: NoSVHC; Case/Package: 0402; Package Reference: 402; Depth: 0.5mm; Package Description: 2-Pin Surface Mount Device, Body 1 x 0.5 mm; Datasheet URL: https://industrial.panasonic.com/cdbs/www-data/pdf/RDA0000/AOA0000C301.pdf; RoHSCompliant: True; Case Code (Imperial): 0402; Military Standard: Not; Min Operating Temperature: -55degC; Power Rating: 100mW; Datasheet Version: 03/2015; Length: 1mm; Case Code (Metric): 1005; Termination: SMD/SMT; Mounting Technology: SurfaceMount; Voltage Rating: 50V; Width: 0.02inch; Package Quantity: 1; Lead Free: LeadFree; Radiation Hardening: No
TP_GND = EMG_R5_TP_GND: UltraLow Profile THM Test Point-No Base; MF: Keystone Electronics; Controlled Revision: R5 2026-09-16; project-local frozen symbol/footprint; SnapEDA_Link: https://www.snapeda.com/parts/5021/Keystone/view-part/?ref=snap; Package: None; Value: *; MP: 5021; Check_prices: https://www.snapeda.com/parts/5021/Keystone/view-part/?ref=eda
TP_MCU_BOOT0 = EMG_R5_TP_MCU_BOOT0: UltraLow Profile THM Test Point-No Base; MF: Keystone Electronics; Controlled Revision: R5 2026-09-16; project-local frozen symbol/footprint; SnapEDA_Link: https://www.snapeda.com/parts/5021/Keystone/view-part/?ref=snap; Package: None; Value: *; MP: 5021; Check_prices: https://www.snapeda.com/parts/5021/Keystone/view-part/?ref=eda
TP_WIFI_BOOT = EMG_R5_TP_WIFI_BOOT: UltraLow Profile THM Test Point-No Base; MF: Keystone Electronics; Controlled Revision: R5 2026-09-16; project-local frozen symbol/footprint; SnapEDA_Link: https://www.snapeda.com/parts/5021/Keystone/view-part/?ref=snap; Package: None; Value: *; MP: 5021; Check_prices: https://www.snapeda.com/parts/5021/Keystone/view-part/?ref=eda
TP_WIFI_CHIP_EN = EMG_R5_TP_WIFI_CHIP_EN: UltraLow Profile THM Test Point-No Base; MF: Keystone Electronics; Controlled Revision: R5 2026-09-16; project-local frozen symbol/footprint; SnapEDA_Link: https://www.snapeda.com/parts/5021/Keystone/view-part/?ref=snap; Package: None; Value: *; MP: 5021; Check_prices: https://www.snapeda.com/parts/5021/Keystone/view-part/?ref=eda
TP_WIFI_UART_RX = EMG_R5_TP_WIFI_UART_RX: UltraLow Profile THM Test Point-No Base; MF: Keystone Electronics; Controlled Revision: R5 2026-09-16; project-local frozen symbol/footprint; SnapEDA_Link: https://www.snapeda.com/parts/5021/Keystone/view-part/?ref=snap; Package: None; Value: *; MP: 5021; Check_prices: https://www.snapeda.com/parts/5021/Keystone/view-part/?ref=eda
TP_WIFI_UART_TX = EMG_R5_TP_WIFI_UART_TX: UltraLow Profile THM Test Point-No Base; MF: Keystone Electronics; Controlled Revision: R5 2026-09-16; project-local frozen symbol/footprint; SnapEDA_Link: https://www.snapeda.com/parts/5021/Keystone/view-part/?ref=snap; Package: None; Value: *; MP: 5021; Check_prices: https://www.snapeda.com/parts/5021/Keystone/view-part/?ref=eda
U_MCU1 = EMG_R5_U_MCU1: Integrated Circuit; Manufacturer_Name: STMicroelectronics; Controlled Revision: R5 2026-09-16; project-local frozen symbol/footprint; Datasheet Link: https://www.st.com/resource/en/datasheet/stm32u575ag.pdf; Height: 1.6mm; Manufacturer_Part_Number: STM32U575VIT6; Mouser Part Number: 511-STM32U575VIT6; Mouser Price/Stock: https://www.mouser.co.uk/ProductDetail/STMicroelectronics/STM32U575VIT6?qs=DRkmTr78QAR9I8TWG1L7Og%3D%3D; Arrow Part Number: STM32U575VIT6; Arrow Price/Stock: https://www.arrow.com/en/products/stm32u575vit6/stmicroelectronics.html?utm_currency=USD&region=nac
U_WIFI1 = EMG_R5_U_WIFI1: Integrated Circuit; Manufacturer_Name: STMicroelectronics; Controlled Revision: R5 2026-09-16; project-local frozen symbol/footprint; Datasheet Link: https://www.st.com/resource/en/datasheet/st67w611m1.pdf; Height: 2.37mm; Manufacturer_Part_Number: ST67W611M1A6BTR; Arrow Part Number: ST67W611M1A6BTR; Arrow Price/Stock: https://www.arrow.com/en/products/st67w611m1a6btr/stmicroelectronics.html?utm_currency=USD&region=nac
X_WIFI_32K = EMG_R5_X_WIFI_32K: Epson FC-135 32.768 kHz 9 pF +/-20 ppm, ESR 70 kohm max, 3.2x1.5 mm, 2 terminals; Manufacturer: Seiko Epson Corporation; Load Capacitance: 9 pF; Tolerance: +/-20 ppm at 25 degC, 0.1 uW; ESR: 70 kohm maximum; Drive Level: 0.1 uW nominal; 0.5 uW maximum; Packaging Note: Q13FC13500003xx; xx=00 is 3000/reel; Controlled Revision: R5 2026-09-16; project-local frozen symbol/footprint; Manufacturer Part Number: Q13FC13500003; Frequency: 32.768 kHz; Package: SMD3215 / 3.2 x 1.5 mm / 2 terminal; Height: 0.8 +/-0.1 mm; Temperature Range: -40 to +85 degC; Datasheet Link: https://download.epsondevice.com/td/pdf/td_xtal_32khz/FC-135_Q13FC13500003_en.pdf; Value: 32.768 kHz

## Assembly variants
PROTO_1: not fitted C_WIFI_BULK C_WIFI_X32_IN C_WIFI_X32_OUT R_TH_BAT
PROTO_1_REMOTE_NTC: not fitted C_DRL_DEC C_DRL_FB C_WIFI_BULK C_WIFI_X32_IN C_WIFI_X32_OUT R_DRL_FB R_DRL_OUT1 R_DRL_OUT2 R_DRL_SEL R_DRL_VA1 R_DRL_VA2 R_DRL_VA3 R_DRL_VA4 R_DRL_VA5 R_DRL_VB1 R_DRL_VB2 R_DRL_VB3 R_DRL_VB4 R_DRL_VB5 R_DRL_VC1 R_DRL_VC2 R_DRL_VC3 R_DRL_VC4 R_DRL_VC5 U_DRL1